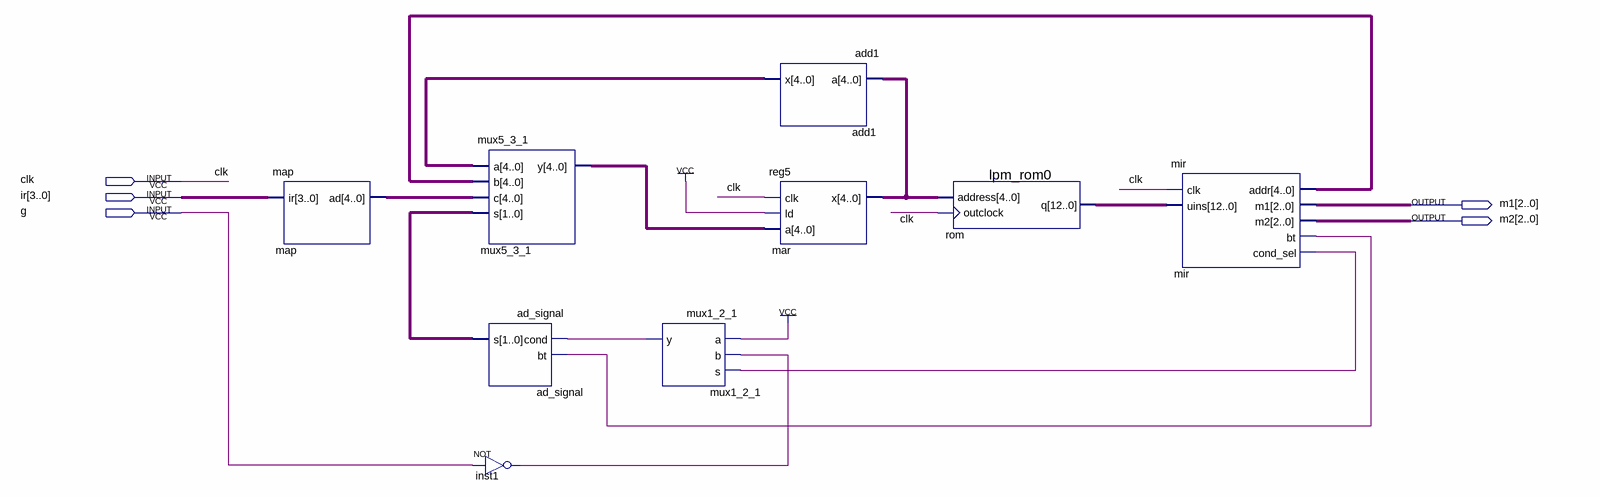
[diagram p0: schematic sheet]
// Quartus schematic mpc.bdf as structural Verilog: 9 symbols, 5 pins
module mpc (
  input  clk,
  input  [3:0] ir,
  input  g,
  output [2:0] m1,
  output [2:0] m2
);

  wire inst1_out, mir_bt, mir_cond_sel, mux1_2_1_y;
  wire [1:0] ad_signal_s;
  wire [4:0] add1_x, map_ad, mar_x, mir_addr, mux5_3_1_y;
  wire [12:0] rom_q;

  map map (.ir(ir), .ad(map_ad));
  mux5_3_1 mux5_3_1 (.a(add1_x), .b(mir_addr), .c(map_ad), .s(ad_signal_s), .y(mux5_3_1_y));
  ad_signal ad_signal (.cond(mux1_2_1_y), .bt(mir_bt), .s(ad_signal_s));
  not inst1 (inst1_out, g);
  mux1_2_1 mux1_2_1 (.a(1'b1), .b(inst1_out), .s(mir_cond_sel), .y(mux1_2_1_y));
  add1 add1 (.a(mar_x), .x(add1_x));
  reg5 mar (.clk(clk), .ld(1'b1), .a(mux5_3_1_y), .x(mar_x));
  lpm_rom0 rom (.address(mar_x), .outclock(clk), .q(rom_q));
  mir mir (.clk(clk), .uins(rom_q), .addr(mir_addr), .m1(m1), .m2(m2), .bt(mir_bt), .cond_sel(mir_cond_sel));
endmodule
